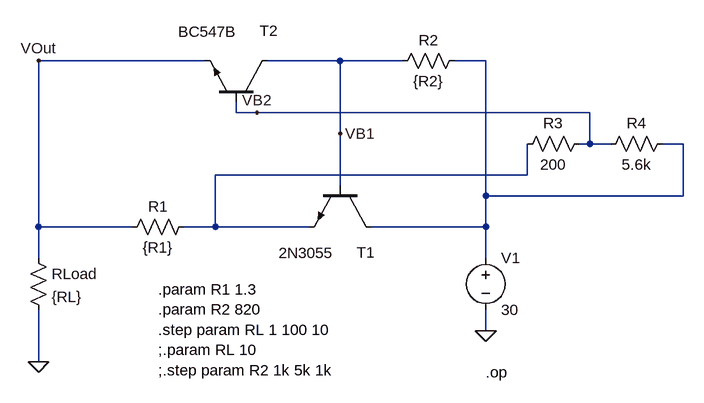
[diagram p0: schematic electronicFuse02.asc]
electronicFuse02.asc, the LTspice schematic file:
Version 4.1
SHEET 1 880 680
WIRE -64 -16 -320 -16
WIRE 144 -16 32 -16
WIRE 240 -16 144 -16
WIRE 368 -16 320 -16
WIRE -16 64 -16 48
WIRE 16 64 -16 64
WIRE 528 64 16 64
WIRE 144 96 144 -16
WIRE 528 112 528 64
WIRE 528 112 512 112
WIRE 560 112 528 112
WIRE 672 112 640 112
WIRE 432 160 432 112
WIRE 432 160 -48 160
WIRE 144 176 144 96
WIRE 368 192 368 -16
WIRE 672 192 672 112
WIRE 672 192 368 192
WIRE -320 240 -320 -16
WIRE -176 240 -320 240
WIRE -48 240 -48 160
WIRE -48 240 -96 240
WIRE 96 240 -48 240
WIRE 368 240 368 192
WIRE 368 240 192 240
WIRE -320 288 -320 240
WIRE 368 288 368 240
WIRE 368 400 368 368
WIRE -320 448 -320 368
FLAG -320 448 0
FLAG 368 400 0
FLAG 144 96 VB1
FLAG 16 64 VB2
FLAG -320 -16 VOut
SYMBOL npn 192 176 R90
WINDOW 0 103 -6 VRight 2
WINDOW 3 104 58 VRight 2
SYMATTR InstName T1
SYMATTR Value 2N3055
SYMBOL npn 32 48 M270
WINDOW 0 110 12 VLeft 2
WINDOW 3 109 137 VLeft 2
SYMATTR InstName T2
SYMATTR Value BC547B
SYMBOL res 336 -32 R90
WINDOW 0 0 56 VBottom 2
WINDOW 3 32 56 VTop 2
SYMATTR InstName R2
SYMATTR Value {R2}
SYMBOL res -80 224 R90
WINDOW 0 0 56 VBottom 2
WINDOW 3 32 56 VTop 2
SYMATTR InstName R1
SYMATTR Value {R1}
SYMBOL voltage 368 272 R0
WINDOW 123 0 0 Left 0
WINDOW 39 0 0 Left 0
SYMATTR InstName V1
SYMATTR Value 30
SYMBOL res -336 272 R0
SYMATTR InstName RLoad
SYMATTR Value {RL}
SYMBOL res 528 96 R90
WINDOW 0 0 56 VBottom 2
WINDOW 3 32 56 VTop 2
SYMATTR InstName R3
SYMATTR Value 200
SYMBOL res 656 96 R90
WINDOW 0 0 56 VBottom 2
WINDOW 3 32 56 VTop 2
SYMATTR InstName R4
SYMATTR Value 5.6k
TEXT 368 464 Left 2 !.op
TEXT -136 336 Left 2 !.param R1 1.3\n.param R2 820\n.step param RL 1 100 10\n;.param RL 10\n;.step param R2 1k 5k 1k

The netlist it stands for:
* electronicFuse02.asc
Q§T1 N001 VB1 N002 0 2N3055
Q§T2 VB1 VB2 VOut 0 BC547B
R2 N001 VB1 {R2}
R1 N002 VOut {R1}
V1 N001 0 30
RLoad VOut 0 {RL}
R3 VB2 N002 200
R4 N001 VB2 5.6k
.model NPN NPN
.model PNP PNP
.lib standard.bjt
.op
.param R1 1.3
.param R2 820
.step param RL 1 100 10
;.param RL 10
;.step param R2 1k 5k 1k
.backanno
.end